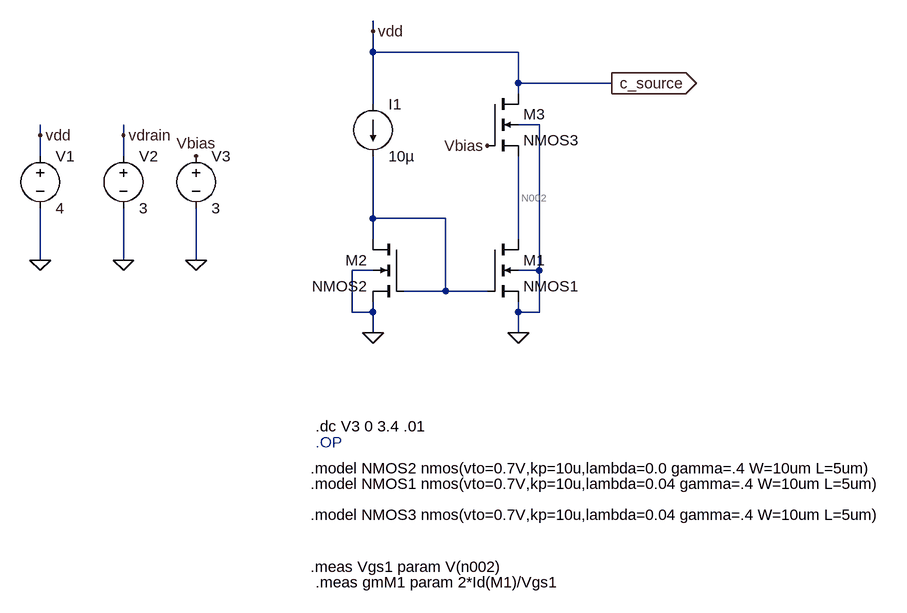
[diagram p0: schematic cascode current mirror.asc]
cascode current mirror.asc, the LTspice schematic file:
Version 4.1
SHEET 1 1188 752
WIRE 224 -112 224 -128
WIRE 224 -80 224 -112
WIRE 448 -80 224 -80
WIRE 448 -32 448 -80
WIRE 592 -32 448 -32
WIRE 448 -16 448 -32
WIRE 224 0 224 -80
WIRE 480 32 448 32
WIRE -288 48 -288 32
WIRE -160 48 -160 32
WIRE -288 80 -288 48
WIRE -160 80 -160 48
WIRE 224 176 224 80
WIRE 336 176 224 176
WIRE 224 208 224 176
WIRE 448 208 448 80
WIRE -288 240 -288 160
WIRE -160 240 -160 160
WIRE -48 240 -48 160
WIRE 224 256 192 256
WIRE 480 256 480 32
WIRE 480 256 448 256
WIRE 336 288 336 176
WIRE 336 288 272 288
WIRE 400 288 336 288
WIRE 192 320 192 256
WIRE 224 320 224 304
WIRE 224 320 192 320
WIRE 448 320 448 304
WIRE 480 320 480 256
WIRE 480 320 448 320
WIRE 224 352 224 320
WIRE 448 352 448 320
FLAG 224 352 0
FLAG 448 352 0
FLAG 224 -112 vdd
FLAG -160 240 0
FLAG -288 240 0
FLAG -288 48 vdd
FLAG -160 48 vdrain
FLAG 400 64 Vbias
FLAG -48 80 Vbias
FLAG -48 240 0
FLAG 592 -32 c_source
IOPIN 592 -32 Out
SYMBOL nmos4 400 208 R0
SYMATTR InstName M1
SYMATTR Value NMOS1
SYMBOL nmos4 272 208 M0
SYMATTR InstName M2
SYMATTR Value NMOS2
SYMBOL current 224 0 R0
WINDOW 123 0 0 Left 0
WINDOW 39 0 0 Left 0
SYMATTR InstName I1
SYMATTR Value 10µ
SYMBOL voltage -288 64 R0
WINDOW 123 0 0 Left 0
WINDOW 39 0 0 Left 0
SYMATTR InstName V1
SYMATTR Value 4
SYMBOL voltage -160 64 R0
WINDOW 123 0 0 Left 0
WINDOW 39 0 0 Left 0
SYMATTR InstName V2
SYMATTR Value 3
SYMBOL voltage -48 64 R0
SYMATTR InstName V3
SYMATTR Value 3
SYMBOL nmos4 400 -16 R0
SYMATTR InstName M3
SYMATTR Value NMOS3
TEXT 136 520 Left 2 ;.OP
TEXT 128 560 Left 2 !.model NMOS2 nmos(vto=0.7V,kp=10u,lambda=0.0 gamma=.4 W=10um L=5um)
TEXT 128 584 Left 2 !.model NMOS1 nmos(vto=0.7V,kp=10u,lambda=0.04 gamma=.4 W=10um L=5um)
TEXT 136 496 Left 2 !.dc V3 0 3.4 .01
TEXT 128 632 Left 2 !.model NMOS3 nmos(vto=0.7V,kp=10u,lambda=0.04 gamma=.4 W=10um L=5um)
TEXT 128 712 Left 2 !.meas Vgs1 param V(n002)
TEXT 136 736 Left 2 !.meas gmM1 param 2*Id(M1)/Vgs1

The netlist it stands for:
* cascode current mirror.asc
M1 N002 N001 0 0 NMOS1
M2 N001 N001 0 0 NMOS2
I1 c_source N001 10µ
V1 c_source 0 4
V2 vdrain 0 3
V3 Vbias 0 3
M3 c_source Vbias N002 0 NMOS3
.model NMOS NMOS
.model PMOS PMOS
.lib standard.mos
* .OP
.model NMOS2 nmos(vto=0.7V,kp=10u,lambda=0.0 gamma=.4 W=10um L=5um)
.model NMOS1 nmos(vto=0.7V,kp=10u,lambda=0.04 gamma=.4 W=10um L=5um)
.dc V3 0 3.4 .01
.model NMOS3 nmos(vto=0.7V,kp=10u,lambda=0.04 gamma=.4 W=10um L=5um)
.meas Vgs1 param V(n002)
.meas gmM1 param 2*Id(M1)/Vgs1
.backanno
.end